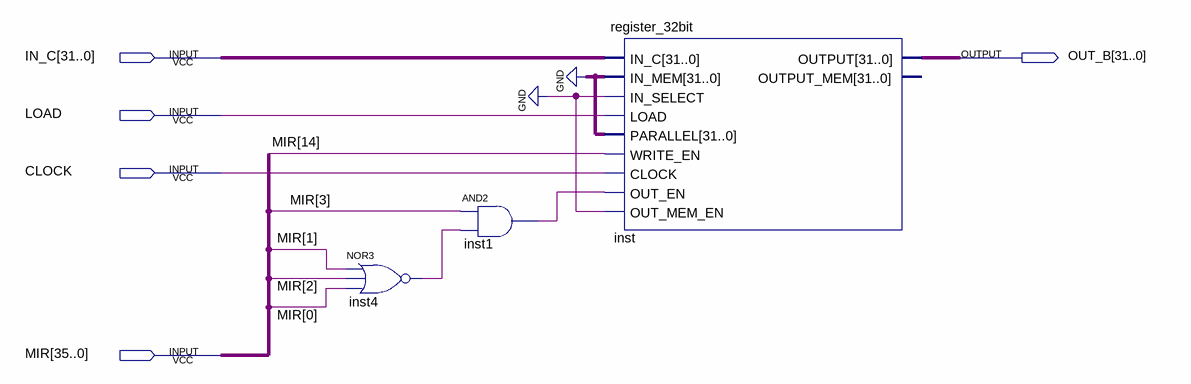
[diagram p0: schematic sheet]
// Quartus schematic OPC.bdf as structural Verilog: 3 symbols, 5 pins
module OPC (
  input  [31:0] IN_C,
  input  LOAD,
  input  CLOCK,
  input  [35:0] MIR,
  output [31:0] OUT_B
);

  wire inst1_out, inst4_out;

  nor inst4 (inst4_out, MIR[1], MIR[2], MIR[0]);
  and inst1 (inst1_out, MIR[3], inst4_out);
  register_32bit inst (
    .IN_C(IN_C), .IN_MEM({32{1'b0}}), .IN_SELECT(1'b0), .LOAD(LOAD), .PARALLEL({32{1'b0}}),
    .WRITE_EN(MIR[14]), .CLOCK(CLOCK), .OUT_EN(inst1_out), .OUT_MEM_EN(1'b0), .OUTPUT(OUT_B));  // open: OUTPUT_MEM
endmodule
